# EAGLE design Kelompok_01_LaporanAkhir_DE2022 (EAGLE 7.2.0)
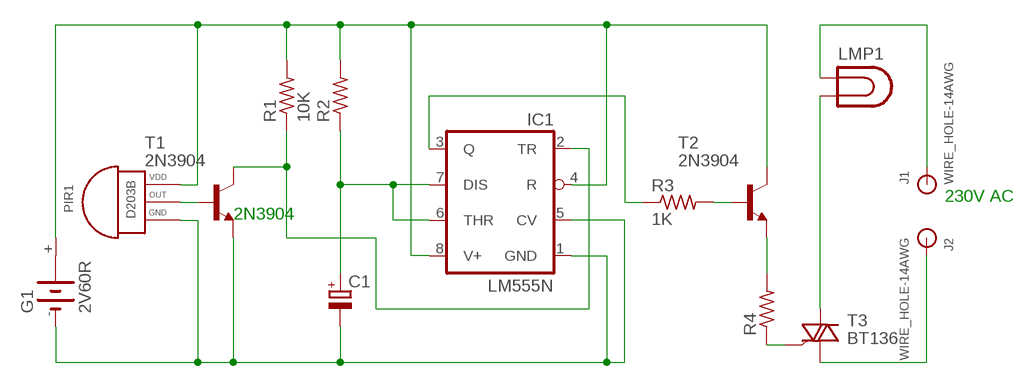
[diagram p0: schematic, sheet 1]

## Parts
C1  CPOL-EUB45181C  [B45181C]
G1  2V60R  [2V60R]
IC1  LM555N  [DIL08]
J1  WIRE_HOLE-14AWG  [WIRE_HOLE-14AWG]
J2  WIRE_HOLE-14AWG  [WIRE_HOLE-14AWG]
LMP1  LAMP  [LDH-5R]
PIR1  D203B  [3PIN]
R1  10K  R-US_0204/7  [0204/7]
R2  R-US_0204/7  [0204/7]
R3  1K  R-US_0204/7  [0204/7]
R4  R-US_0204/7  [0204/7]
T1  2N3904  [TO92]
T2  2N3904  [TO92]
T3  BT136  [TO220AB]

## Nets
N$1: PIR1.2(OUT) T1.2(B)
N$2: IC1.2(TR) R1.1 T1.1(C)
N$3: G1.+ IC1.4(R) IC1.8(V+) PIR1.1(VDD) R1.2 R2.2 T2.1(C)
N$4: C1.- G1.- IC1.1(GND) IC1.5(CV) PIR1.3(GND) T1.3(E)
N$5: C1.+ IC1.6(THR) IC1.7(DIS) R2.1
N$6: IC1.3(Q) R3.1
N$7: R3.2 T2.2(B)
N$8: R4.2 T2.3(E)
N$9: R4.1 T3.3(G)
N$10: LMP1.2 T3.2(A2)
N$11: J1.P$1 LMP1.1
N$12: J2.P$1 T3.1(A1)
Unconnected: G1.+@1(+)

## Notes on the sheet
- 230V AC
- 2N3904

## Library data of the parts
C1 = resistor:CPOL-EU: POLARIZED CAPACITOR, European symbol
G1 = battery:2V60R: NC ACCU Varta
IC1 = linear:*555: TIMER
J1 J2 = ac:WIRE_HOLE-14AWG: Solder point for 14AWG wire
LMP1 = special:LAMP: LED HOLDER
PIR1 = senba-pir-sensor:D203B
R1-R4 = resistor:R-US_: RESISTOR, American symbol
T1 T2 = transistor:2N3904: NPN TRANSISTOR
T3 = triac:BT136: Triac BT136 series E sensitive gate Source: http://www.nxp.com/acrobat_download/datasheets/BT136_SERIES_E_2.pdf

## Board
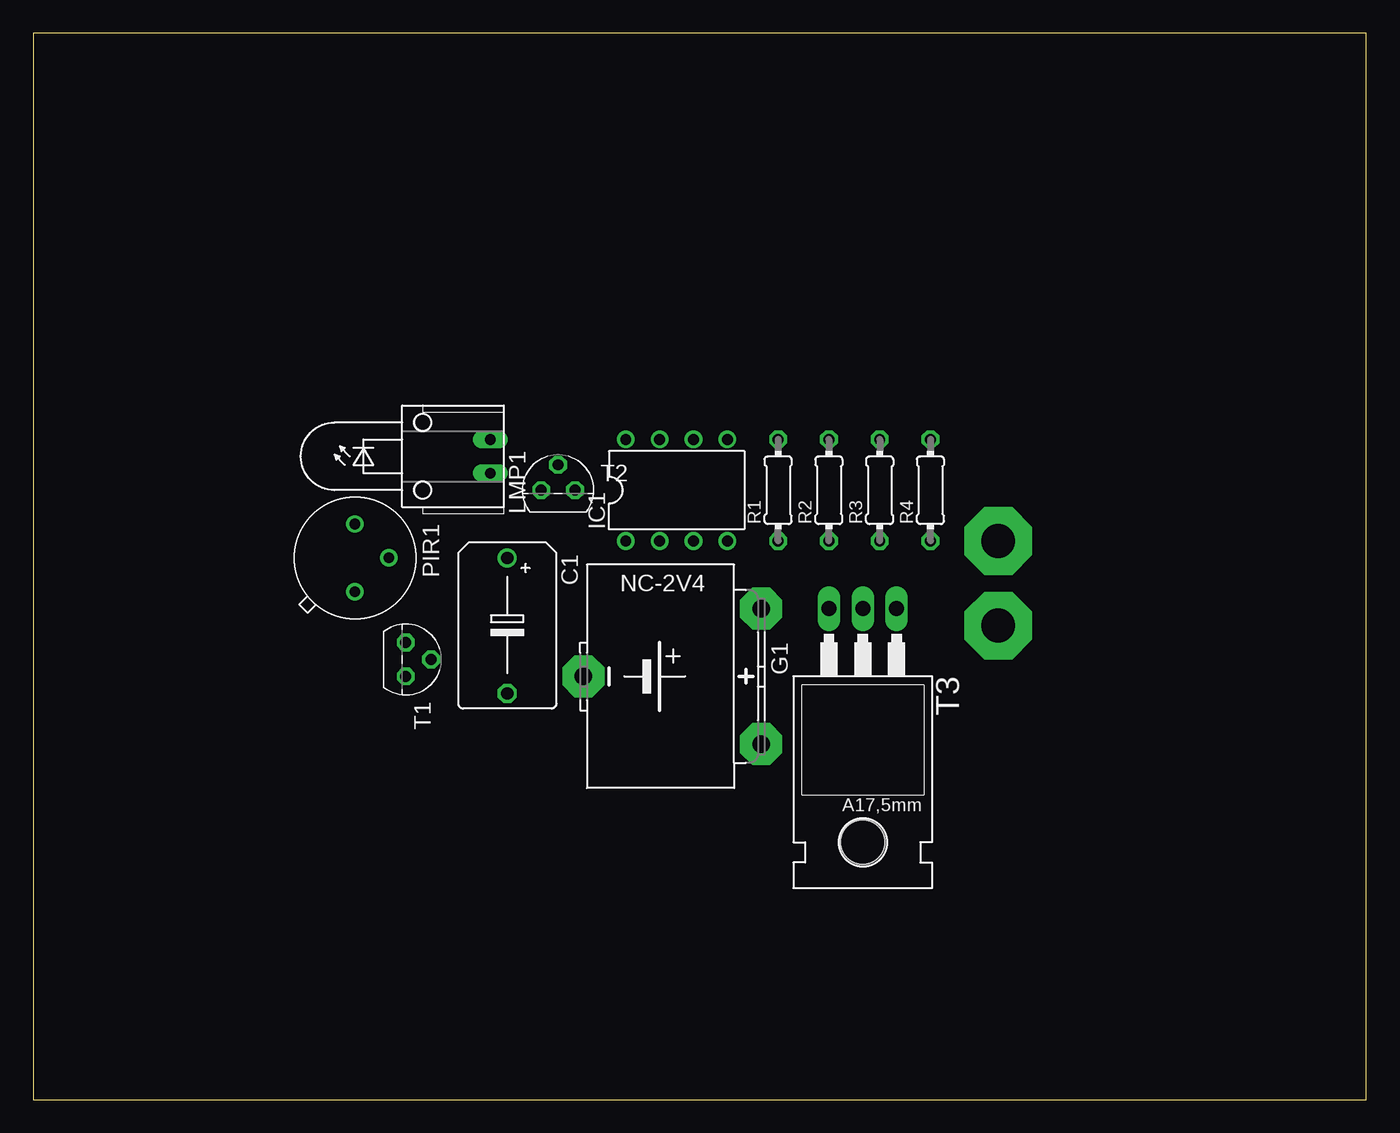
[diagram p1: board, top side]
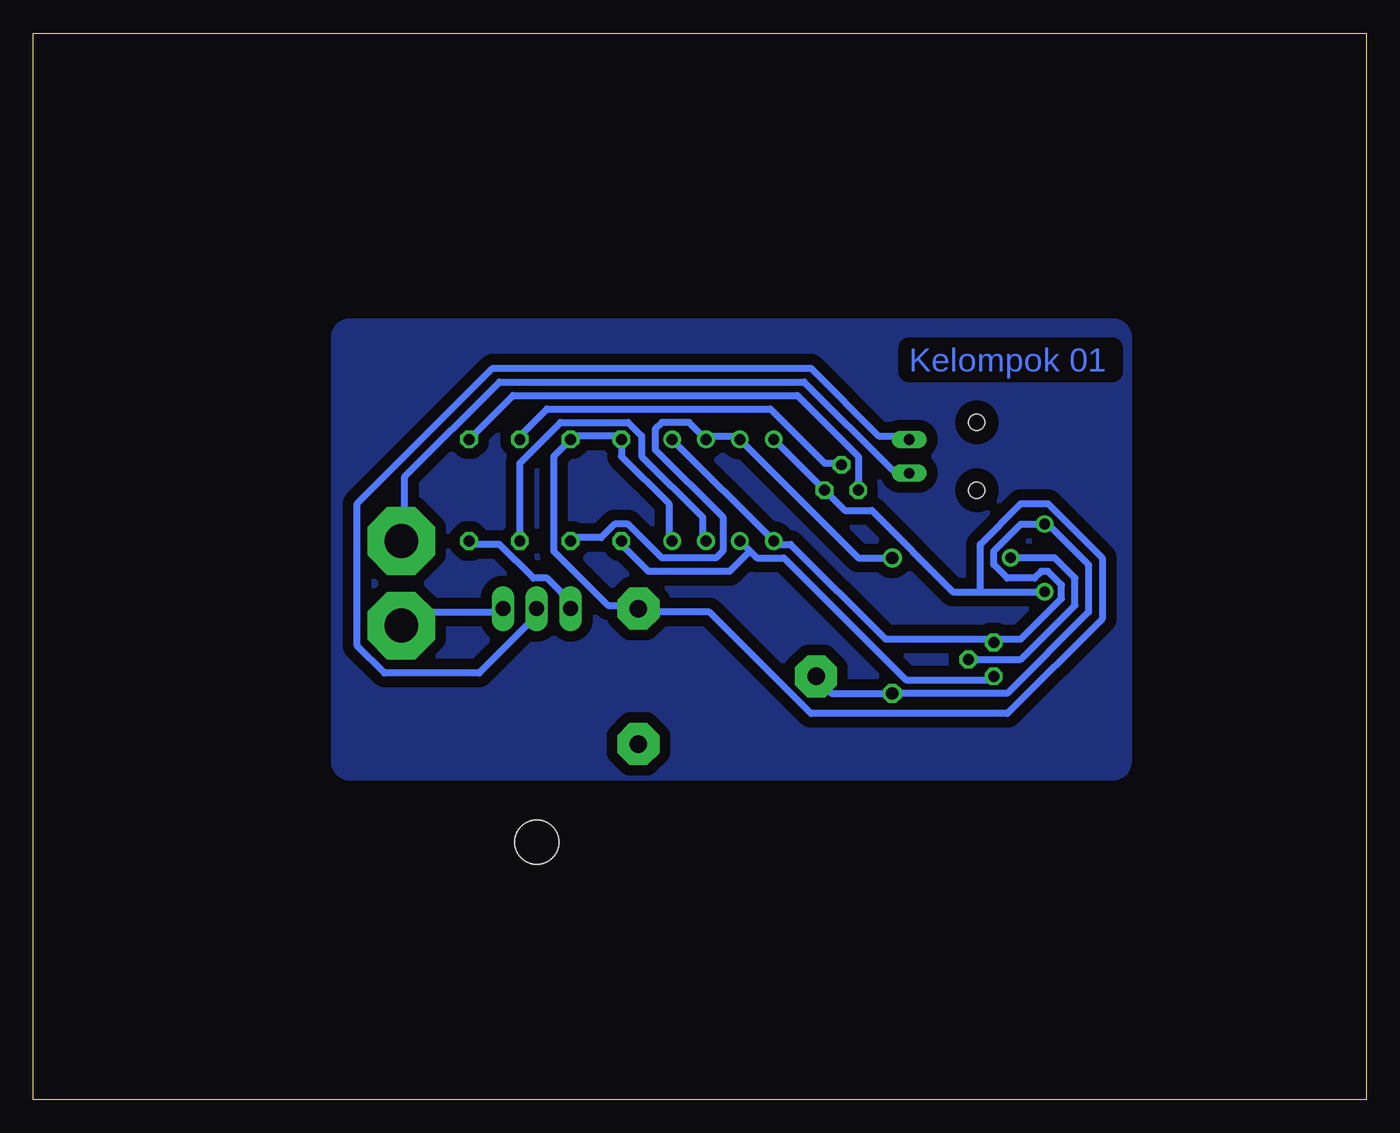
[diagram p2: board, bottom side, seen from below]

Size 100 x 80 mm. Coordinates in mm from the lower left corner, seen from the top.
Outline: 0,0 100,0 100,80 0,80 0,0
Copper layers (1*16): Top 0.035mm / dielectric 1.5mm / Bottom 0.035mm
Design rules "default *": minimum track width 20mil, minimum drill 24mil, track to track 20mil, track to pad 12mil, pad to pad 8mil, via to via 8mil, smd to smd 8mil, copper to edge 40mil, drill to drill 8mil, minimum pad ring 10mil, minimum via ring 8mil, stop-mask expansion 4mil, vias tented up to drill 0mil, thermal gap 10mil

### Footprints (pad centres in the part's own frame; a part is rotated, then mirrored left to right if it is on the bottom)
B45181C = drill 0.914: + -5.08,0 | drill 0.914 octagon: - 5.08,0
2V60R = drill 1.321 pad 3.15 octagon: + -7.62,-5.08; +@1 -7.62,5.08; - 5.715,0
DIL08 = drill 0.813 pad 1.27: 1 -3.81,-3.81; 2 -1.27,-3.81; 3 1.27,-3.81; 4 3.81,-3.81; 5 3.81,3.81; 6 1.27,3.81; 7 -1.27,3.81; 8 -3.81,3.81
WIRE_HOLE-14AWG = drill 2.54 pad 5.08 octagon: P$1 0,0
LDH-5R = drill 0.813 long: 1 -1.27,-5.08; 2 1.27,-5.08 | hole 1.219: 2.54,0; -2.54,0
3PIN = drill 0.8: 1 2.54,0; 2 0,2.54; 3 -2.54,0
0204/7 = drill 0.813 octagon: 1 -3.81,0; 2 3.81,0
TO92 = drill 0.813 octagon: 1 1.27,0; 2 0,1.905; 3 -1.27,0
TO220AB = drill 1.118 long: 1 -2.54,-6.35; 2 0,-6.35; 3 2.54,-6.35 | hole 3.302: 0,11.176

### Placement (x,y rotation side)
C1  35.56,35.56 270 top
G1  46.99,31.75 180 top
IC1  48.26,45.72 0 top
J1  72.39,41.91 0 top
J2  72.39,35.56 0 top
LMP1  29.21,48.26 90 top
PIR1  24.13,40.64 270 top
R1  55.88,45.72 90 top
R2  59.69,45.72 90 top
R3  63.5,45.72 90 top
R4  67.31,45.72 90 top
T1  27.94,33.02 270 top
T2  39.37,45.72 0 top
T3  62.23,30.48 180 top

### Tracks (layer width: path | path; a pad name or v marks a point on that pad's centre or on a via)
N$1
  Bottom 0.508: PIR1.2 23.37,40.64 21.84,39.12 21.84,37.08 25.91,33.02 T1.2
N$2
  Bottom 0.508: IC1.2 46.23,41.15 | 46.23,41.15 45.72,40.64 43.69,40.64 34.54,31.5 27.94,31.5 T1.1 | 46.23,41.15 47.75,39.62 53.85,39.62 55.88,41.66 R1.1
N$3
  Bottom 0.508: IC1.4 52.32,42.16 52.32,44.7 55.88,48.26 R1.2 55.88,49.78 59.44,49.78 R2.2 60.96,48.26 60.96,41.15 56.9,37.08 54.86,37.08 G1.+ 54.36,36.58 49.28,36.58 41.66,28.96 26.92,28.96 19.81,36.07 19.81,40.64 23.88,44.7 25.91,44.7 28.96,41.66 28.96,38.1 | 28.96,38.1 30.99,38.1 37.08,44.2 39.12,44.2 T2.1 IC1.8 | 28.96,38.1 PIR1.1
N$4
  Bottom 0.508: G1.- 41.15,31.5 40.13,30.48 C1.- 26.92,30.48 20.83,36.58 20.83,40.13 23.88,43.18 PIR1.3 25.91,43.18 27.94,41.15 27.94,40.13 26.92,39.12 24.89,39.12 24.38,39.62 23.88,39.62 22.86,38.61 22.86,37.59 25.91,34.54 27.94,34.54 | IC1.5 IC1.1 44.2,41.66 43.18,41.66 36.07,34.54 27.94,34.54 | 27.94,34.54 T1.3
N$5
  Bottom 0.508: R2.1 59.44,42.16 57.4,42.16 56.39,43.18 55.37,43.18 52.83,40.64 48.77,40.64 48.26,41.15 48.26,43.69 53.34,48.77 53.34,50.29 52.83,50.8 50.8,50.8 IC1.6 49.28,49.78 47.24,49.78 IC1.7 38.1,40.64 C1.+
N$6
  Bottom 0.508: R3.1 63.5,47.75 60.45,50.8 55.37,50.8 54.36,49.78 54.36,48.26 49.78,43.69 49.78,42.16 IC1.3
N$7
  Bottom 0.508: T2.2 39.62,47.75 40.64,47.75 44.7,51.82 61.47,51.82 63.5,49.78 R3.2
N$8
  Bottom 0.508: T2.3 38.1,48.26 42.67,52.83 64.01,52.83 R4.2
N$9
  Bottom 0.508: R4.1 67.06,41.66 65.02,41.66 62.48,39.12 61.47,39.12 59.44,37.08 T3.3
N$10
  Bottom 0.508: LMP1.2 34.54,49.78 36.58,49.78 41.66,54.86 65.53,54.86 75.69,44.7 75.69,34.04 73.66,32 66.55,32 61.98,36.58 T3.2
N$11
  Bottom 0.508: LMP1.1 34.54,47.24 35.56,47.24 42.16,53.85 65.02,53.85 72.14,46.74 72.14,42.16 J1.P$1
N$12
  Bottom 0.508: T3.1 65.02,36.58 71.12,36.58 72.14,35.56 J2.P$1
N$13
  pour Bottom (isolate 0.813): 17.78,57.15 arc-90 19.05,58.42 74.93,58.42 76.2,58.42 arc-90 77.47,57.15 77.47,26.67 77.47,25.4 arc-90 76.2,24.13 20.32,24.13 19.05,24.13 arc-90 17.78,25.4

### Text on the board
Bottom: Kelompok 01